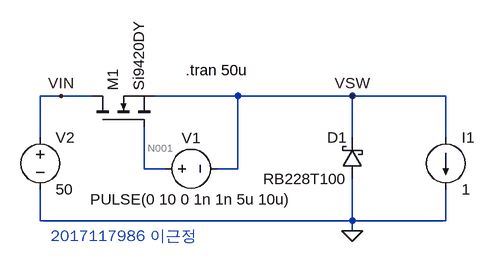
[diagram p0: schematic HW2.asc]
HW2.asc, the LTspice schematic file:
Version 4
SHEET 1 880 680
WIRE -32 112 -64 112
WIRE 16 112 -32 112
WIRE 240 112 112 112
WIRE 416 112 240 112
WIRE 560 112 416 112
WIRE -64 176 -64 112
WIRE 416 176 416 112
WIRE 560 176 560 112
WIRE 96 224 96 160
WIRE 128 224 96 224
WIRE 240 224 240 112
WIRE 240 224 208 224
WIRE -64 304 -64 256
WIRE 416 304 416 240
WIRE 416 304 -64 304
WIRE 560 304 560 256
WIRE 560 304 416 304
WIRE 416 320 416 304
FLAG -32 112 VIN
FLAG 416 112 VSW
FLAG 416 320 0
SYMBOL voltage 112 224 R270
WINDOW 0 32 56 VTop 2
WINDOW 3 -32 56 VBottom 2
WINDOW 123 0 0 Left 0
WINDOW 39 0 0 Left 0
SYMATTR InstName V1
SYMATTR Value PULSE(0 10 0 1n 1n 5u 10u)
SYMBOL voltage -64 160 R0
WINDOW 123 0 0 Left 0
WINDOW 39 0 0 Left 0
SYMATTR InstName V2
SYMATTR Value 50
SYMBOL nmos 16 160 R270
SYMATTR InstName M1
SYMATTR Value Si9420DY
SYMBOL schottky 432 240 R180
WINDOW 0 24 64 Left 2
WINDOW 3 24 0 Left 2
SYMATTR InstName D1
SYMATTR Value RB228T100
SYMATTR Description Diode
SYMATTR Type diode
SYMBOL current 560 176 R0
WINDOW 123 0 0 Left 0
WINDOW 39 0 0 Left 0
SYMATTR InstName I1
SYMATTR Value 1
TEXT -48 328 Left 2 ;2017117986 이근정
TEXT 160 72 Left 2 !.tran 50u

The netlist it stands for:
* HW2.asc
V1 N001 VSW PULSE(0 10 0 1n 1n 5u 10u)
V2 VIN 0 50
M1 VIN N001 VSW VSW Si9420DY
D1 0 VSW RB228T100
I1 VSW 0 1
.model D D
.lib standard.dio
.model NMOS NMOS
.model PMOS PMOS
.lib standard.mos
* 2017117986 이근정
.tran 50u
.backanno
.end

* Results of the author's LTspice run, read from the files saved beside the schematic
* Operating Point, zero values left out:
*   V(n001) = -586 mV
*   V(vsw) = -586 mV
*   V(vin) = 50 V
*   Id(M1) = 67.79 pA
*   Is(M1) = -67.79 pA
*   I(D1) = 1 A
*   I(I1) = 1 A
*   I(V2) = -118.4 pA
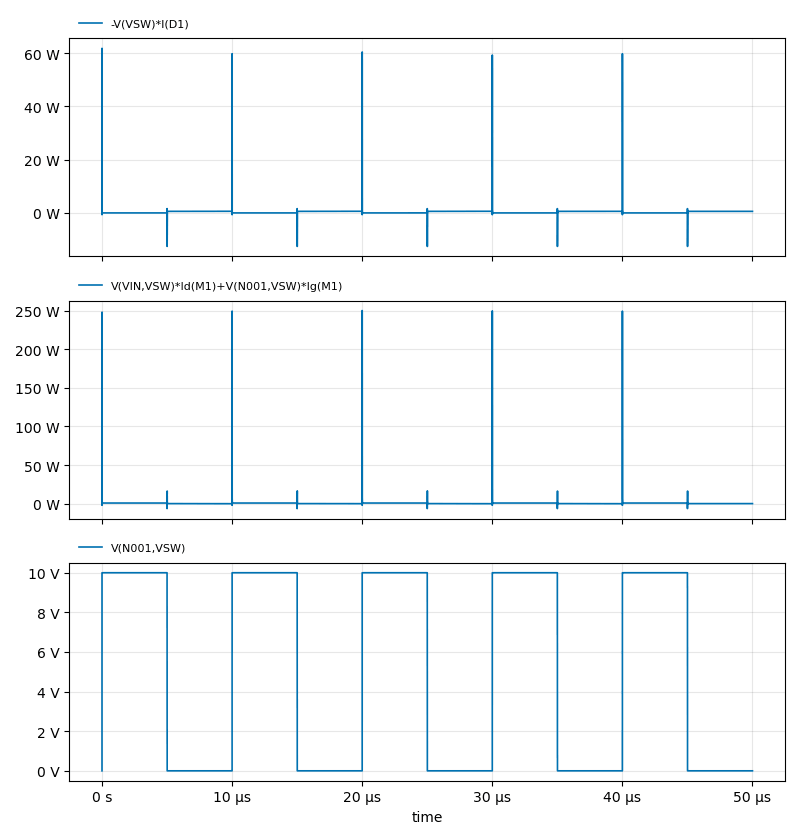
[diagram p1: Transient Analysis of HW2.asc, plotted from the saved traces]
* Transient Analysis, 1 run:
*   -V(VSW)*I(D1): min -12.6 W, max 61.86 W, average 292.1 mW, rms 744.7 mW, last 586 mW
*   V(VIN,VSW)*Id(M1)+V(N001,VSW)*Ig(M1): min -6.519 W, max 250.2 W, average 404.7 mW, rms 2.182 W, last -37.26 µW
*   V(N001,VSW): min 0 V, max 10 V, average 5.001 V, rms 7.072 V, last 0 V